# EAGLE design AS32 (EAGLE 7.6.0)
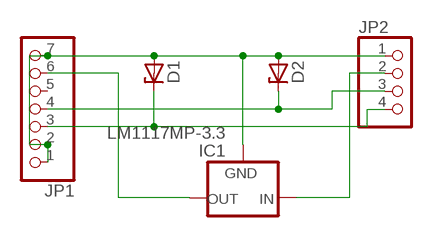
[diagram p0: schematic, sheet 1]

## Parts
D1  ZENER-DIODEDO35Z10  [DO35Z10]
D2  ZENER-DIODEDO35Z10  [DO35Z10]
IC1  LM1117MP-3.3  [SOT223]
JP1  PINHD-1X7  [1X07]
JP2  PINHD-1X4  [1X04]

## Nets
GND: D1.A D2.A IC1.1(GND) JP1.1 JP1.2 JP1.7 JP2.1
N$1: IC1.3(IN) JP2.2
N$2: IC1.2(OUT) IC1.4(OUT) JP1.6
N$4: D2.C JP1.4 JP2.3
N$5: D1.C JP1.3 JP2.4
Unconnected: JP1.5

## Library data of the parts
D1 D2 = diode:ZENER-DIODE: Z-Diode
IC1 = lm1117:LM1117?-*: 800mA Low-Dropout Linear Regulator Source: http://ww1.microchip.com/downloads/en/DeviceDoc/39760d.pdf; MF: Texas Instruments; MPN: LM1117MP-3.3; OC_FARNELL: 9778195; OC_NEWARK: 28X3416
JP1 = pinhead:PINHD-1X7: PIN HEADER
JP2 = pinhead:PINHD-1X4: PIN HEADER

## Board
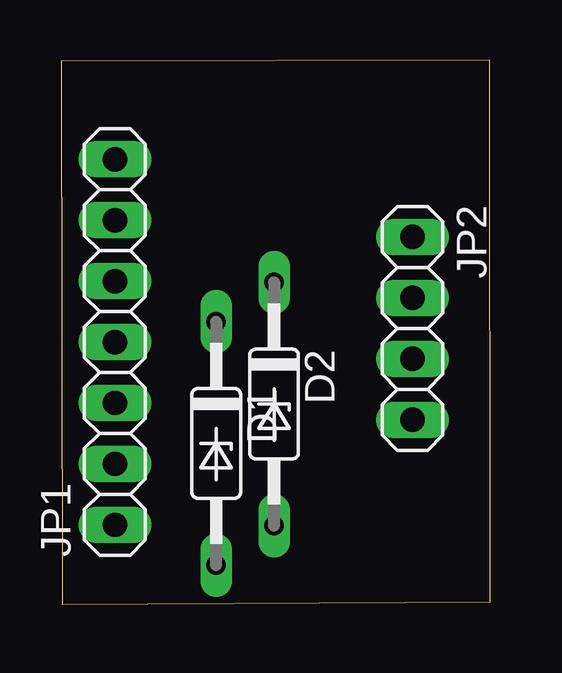
[diagram p1: board, top side]
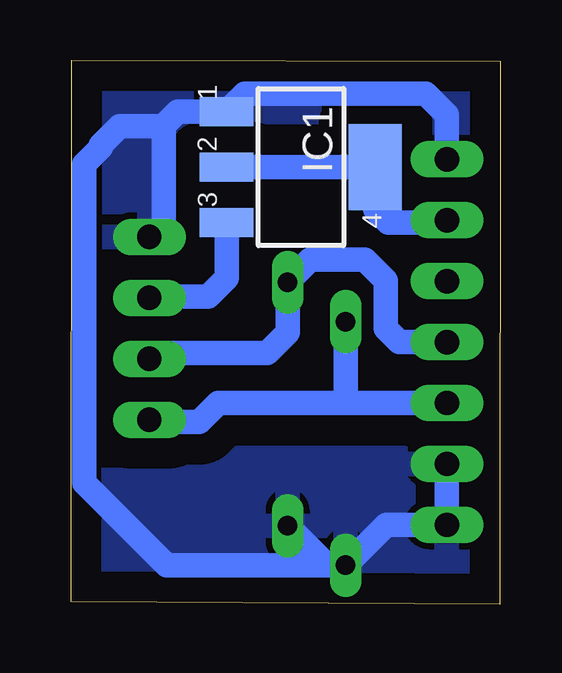
[diagram p2: board, bottom side, seen from below]

Size 17.88 x 22.7 mm. Coordinates in mm from the lower left corner, seen from the top.
Outline: 0.03,0 17.88,0.11 17.86,22.7 0,22.64 0.03,0
Copper layers (1*16): Top 0.035mm / dielectric 1.5mm / Bottom 0.035mm
Design rules "default": minimum track width 10mil, minimum drill 24mil, track to track 8mil, track to pad 8mil, pad to pad 8mil, via to via 8mil, smd to smd 8mil, copper to edge 40mil, drill to drill 8mil, minimum pad ring 10mil, minimum via ring 8mil, stop-mask expansion 4mil, vias tented up to drill 0mil, thermal gap 10mil

### Footprints (pad centres in the part's own frame; a part is rotated, then mirrored left to right if it is on the bottom)
DO35Z10 = drill 0.813 long: A 5.08,0; C -5.08,0
SOT223 = smd 1.219 x 2.235: 1 -2.311,-3.099; 2 0,-3.099; 3 2.311,-3.099 | smd 3.6 x 2.2: 4 0,3.099
1X07 = drill 1.016 long: 1 -7.62,0; 2 -5.08,0; 3 -2.54,0; 4 0,0; 5 2.54,0; 6 5.08,0; 7 7.62,0
1X04 = drill 1.016 long: 1 -3.81,0; 2 -1.27,0; 3 1.27,0; 4 3.81,0

### Placement (x,y rotation side)
D1  6.45,6.71 270 top
D2  8.86,8.35 270 top
IC1  8.31,18.23 270 bottom
JP1  2.23,10.94 90 top
JP2  14.63,11.51 270 top

### Tracks (layer width: path | path; a pad name or v marks a point on that pad's centre or on a via)
GND
  Bottom 1.016: JP1.7 2.23,20.43 3.11,21.3 10.65,21.3 IC1.1 13.45,20.54 14.04,19.96 | 14.04,19.96 14.04,15.65 JP2.1 | D1.A 7.22,1.63 D2.A | D1.A 13.89,1.63 17.34,5.07 17.34,18.35 16.65,19.04 16.65,19.15 15.85,19.95 14.04,19.95 14.04,19.96 | JP1.2 JP1.1 4.77,3.32 D1.A
  pour Bottom (isolate 1.27): 0.17,22.69 17.42,22.69 17.42,0.23 0.08,0.23 0.08,22.77
N$1
  Bottom 1.016: IC1.3 11.41,13.6 12.18,12.83 14.16,12.83 JP2.2
N$2
  Bottom 1.016: IC1.2 IC1.4 5.21,16.47 4.67,15.92 2.33,15.92 JP1.6
N$4
  Bottom 1.016: JP1.4 4.22,10.94 4.78,11.5 4.78,13.5 5.65,14.37 7.93,14.37 D2.C 8.86,11.33 9.72,10.48 14.13,10.48 JP2.3
N$5
  Bottom 1.016: JP1.3 6.56,8.4 | 6.56,8.4 11.76,8.4 12.55,7.6 14.01,7.6 JP2.4 | D1.C 6.45,8.5 6.56,8.4